# Altium schematic sheet project_9.SchDoc
size A4; SheetNumber: 1; SheetTotal: 1
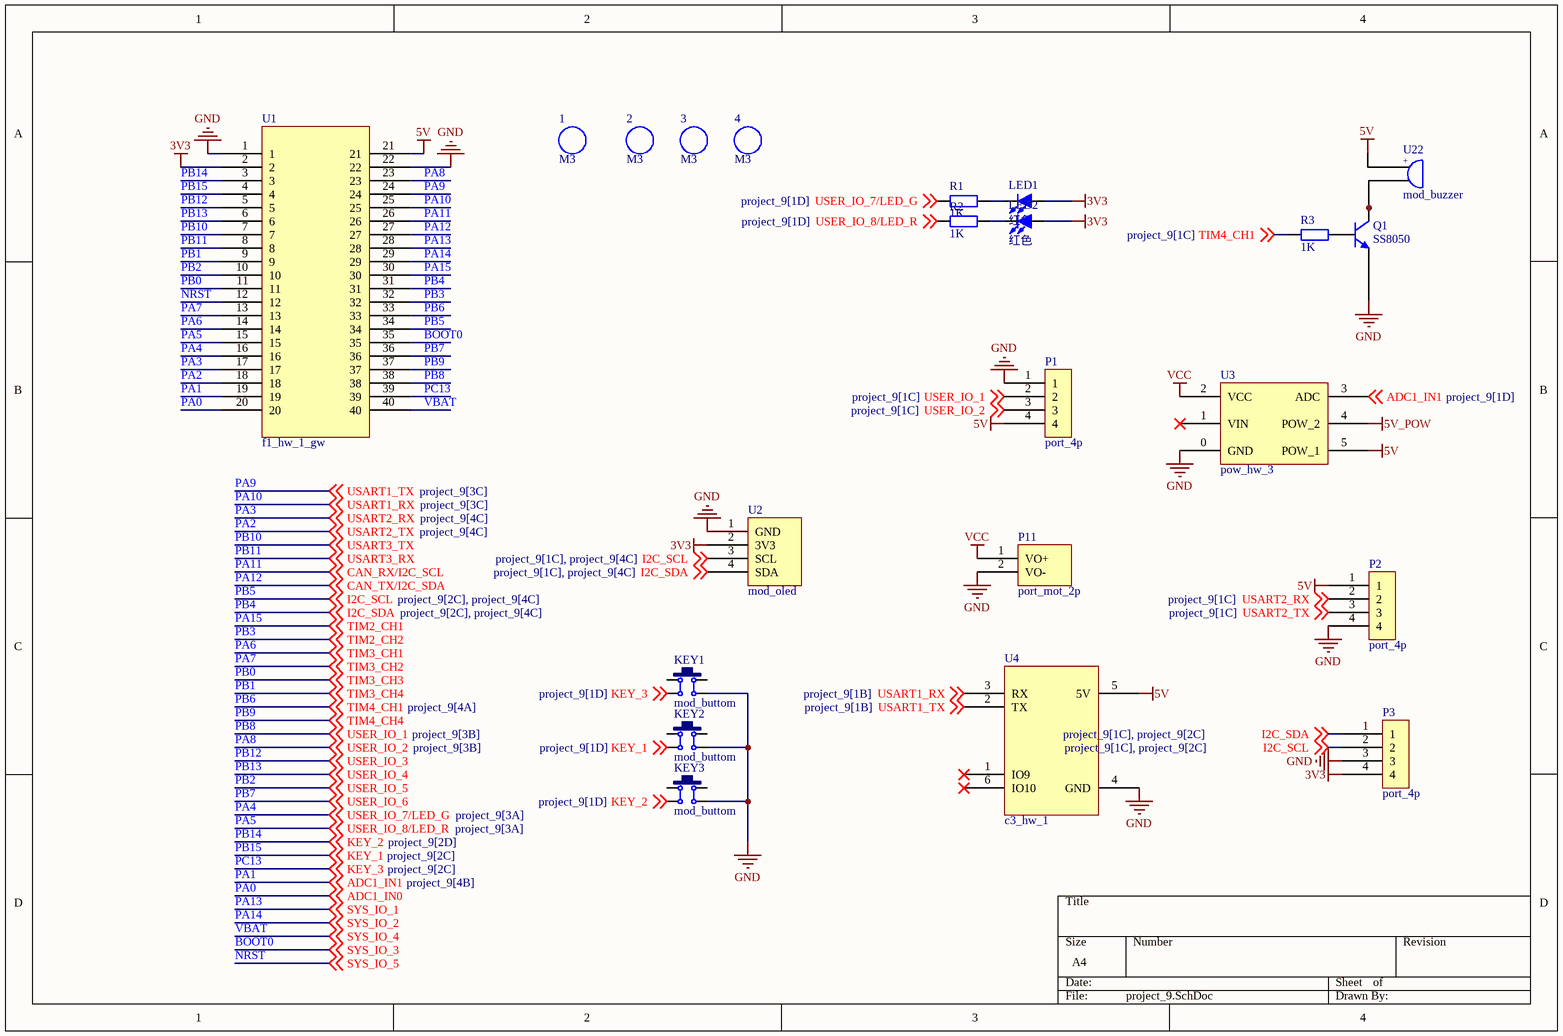
[diagram p0: project_9.SchDoc]

## Parts
1  M3  [M3 125X200]
2  M3  [M3 125X200]
3  M3  [M3 125X200]
4  M3  [M3 125X200]
KEY1  mod_buttom  [MOD_BUTTOM]
KEY2  mod_buttom  [MOD_BUTTOM]
KEY3  mod_buttom  [MOD_BUTTOM]
LED1  红色  [LED 3MM-B]
LED2  红色  [LED 3MM-B]
P1  port_4p  [MOD_ECHO(XH2.54)]
P2  port_4p  [MOD_RS485]
P3  port_4p  [MOD_TEMP]
P11  port_mot_2p  [XH2.54_2P]
Q1  SS8050  [SOT23-3L]
R1  1K  [R 0603_L]
R2  1K  [R 0603_L]
R3  1K  [R 0603_L]
U1  f1_hw_1_gw  [F1_HW_1_GW]
U2  mod_oled  [MOD_OLED]
U3  pow_hw_3  [POW_HW_3]
U4  c3_hw_1  [C3_HW_1]
U22  mod_buzzer  [MOD_BUZZER]

## Nets
3V3: LED1.1(A) LED2.1(A) P3.4 U1.2 U2.2(3V3)
5V: P1.4 P2.1 U1.21 U3.5(POW_1) U4.5(5V) U22.1
5V_POW: U3.4(POW_2)
GND: KEY1.3 KEY2.3 KEY3.3 P1.1 P2.4 P3.3 P11.2(VO-) Q1.2(E) U1.1 U1.22 U2.1(GND) U3.0(GND) U4.4(GND)
VCC: P11.1(VO+) U3.2(VCC)
BOOT0: U1.35 ; off-sheet SYS_IO_3  [also labelled SYS_IO_3]
NRST: U1.12 ; off-sheet SYS_IO_5  [also labelled SYS_IO_5]
PA0: U1.20 ; off-sheet ADC1_IN0  [also labelled ADC1_IN0]
PA1: U1.19 U3.3(ADC) ; off-sheet ADC1_IN1  [also labelled ADC1_IN1]
PA2: P2.3 U1.18 ; off-sheet USART2_TX  [also labelled USART2_TX]
PA3: P2.2 U1.17 ; off-sheet USART2_RX  [also labelled USART2_RX]
PA4: R1.1 U1.16 ; off-sheet USER_IO_7/LED_G  [also labelled USER_IO_7/LED_G]
PA5: R2.1 U1.15 ; off-sheet USER_IO_8/LED_R  [also labelled USER_IO_8/LED_R]
PA6: U1.14 ; off-sheet TIM3_CH1  [also labelled TIM3_CH1]
PA7: U1.13 ; off-sheet TIM3_CH2  [also labelled TIM3_CH2]
PA8: P1.3 U1.23 ; off-sheet USER_IO_2  [also labelled USER_IO_2]
PA9: U1.24 U4.2(TX) ; off-sheet USART1_TX  [also labelled USART1_TX]
PA10: U1.25 U4.3(RX) ; off-sheet USART1_RX  [also labelled USART1_RX]
PA11: U1.26 ; off-sheet CAN_RX/I2C_SCL  [also labelled CAN_RX/I2C_SCL]
PA12: U1.27 ; off-sheet CAN_TX/I2C_SDA  [also labelled CAN_TX/I2C_SDA]
PA13: U1.28 ; off-sheet SYS_IO_1  [also labelled SYS_IO_1]
PA14: U1.29 ; off-sheet SYS_IO_2  [also labelled SYS_IO_2]
PA15: U1.30 ; off-sheet TIM2_CH1  [also labelled TIM2_CH1]
PB0: U1.11 ; off-sheet TIM3_CH3  [also labelled TIM3_CH3]
PB1: U1.9 ; off-sheet TIM3_CH4  [also labelled TIM3_CH4]
PB2: U1.10 ; off-sheet USER_IO_5  [also labelled USER_IO_5]
PB3: U1.32 ; off-sheet TIM2_CH2  [also labelled TIM2_CH2]
PB4: P3.1 U1.31 U2.4(SDA) ; off-sheet I2C_SDA  [also labelled I2C_SDA]
PB5: P3.2 U1.34 U2.3(SCL) ; off-sheet I2C_SCL  [also labelled I2C_SCL]
PB6: R3.1 U1.33 ; off-sheet TIM4_CH1  [also labelled TIM4_CH1]
PB7: U1.36 ; off-sheet USER_IO_6  [also labelled USER_IO_6]
PB8: P1.2 U1.38 ; off-sheet USER_IO_1  [also labelled USER_IO_1]
PB9: U1.37 ; off-sheet TIM4_CH4  [also labelled TIM4_CH4]
PB10: U1.7 ; off-sheet USART3_TX  [also labelled USART3_TX]
PB11: U1.8 ; off-sheet USART3_RX  [also labelled USART3_RX]
PB12: U1.5 ; off-sheet USER_IO_3  [also labelled USER_IO_3]
PB13: U1.6 ; off-sheet USER_IO_4  [also labelled USER_IO_4]
PB14: KEY3.4 U1.3 ; off-sheet KEY_2  [also labelled KEY_2]
PB15: KEY2.4 U1.4 ; off-sheet KEY_1  [also labelled KEY_1]
PC13: KEY1.4 U1.39 ; off-sheet KEY_3  [also labelled KEY_3]
VBAT: U1.40 ; off-sheet SYS_IO_4  [also labelled SYS_IO_4]
NetLED1_2: LED1.2(K) R1.2
NetLED2_2: LED2.2(K) R2.2
NetQ1_1: Q1.1(B) R3.2
NetQ1_3: Q1.3(C) U22.2

Not connected (* = marked no-connect by the designer): KEY1 1 2; KEY2 1 2; KEY3 1 2; U3 1(VIN)*; U4 1(IO9)* 6(IO10)*

## Notes on the sheet
- (in symbol mod_buzzer) +

## Library data of the parts
1-4 = prot_m3: m3铜柱孔; BOM名称: 铜柱孔; 版权归属: 源创客; 学习资源: www.ooocke.com
KEY1-KEY3 = mod_buttom: 6*6*4.3按键
LED1 LED2 = mod_LED: 插件LED; 版权归属: 源创客; BOM名称: 插件LED; 学习资源: www.ooocke.com
P1-P3 = port_4p: 4P模块接口
P11 = port_mot_2p: 开环直流电机接口 / XH2.54弯排针2p
Q1 = 8050-SMD: 高频放大-NPN型; 版权归属: 源创客; 属性: 40V 1.5A 1W 100MHZ; BOM名称: 高频放大-NPN型; 学习资源: www.ooocke.com
R1-R3 = R: 贴片电阻; 版权归属: 源创客; BOM名称: 贴片电阻; 学习资源: www.ooocke.com
U2 = mod_oled: oled模块 / 4p排母
U4 = c3_hw_1: ESP32C3蓝牙模块 / 6p排母
U22 = mod_buzzer: 有源蜂鸣器